# Altium schematic sheet RS232_485_dsPIC30.SchDoc
size A
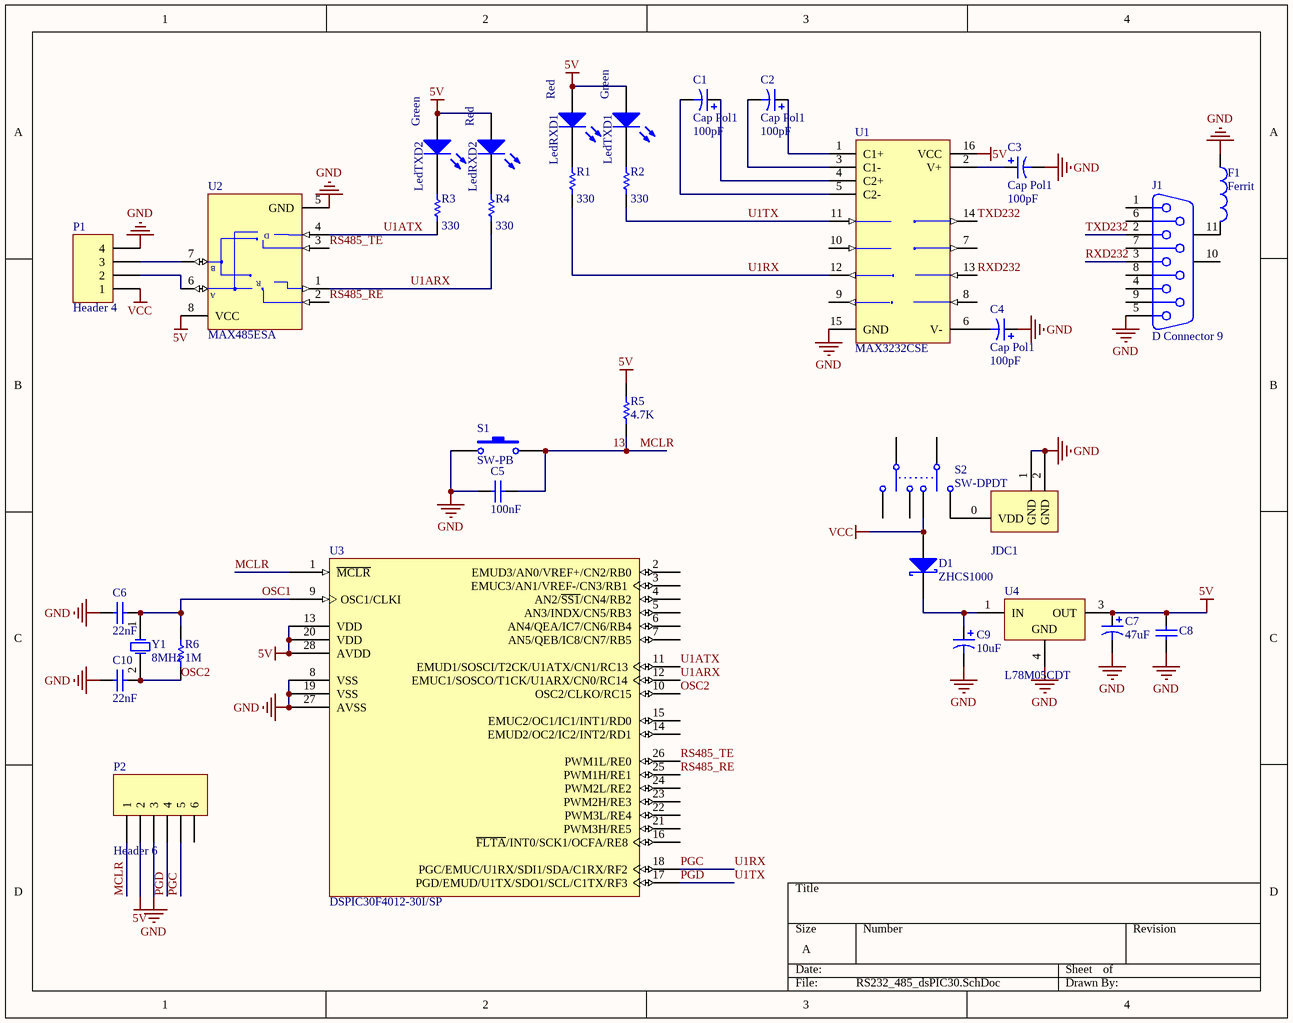
[diagram p0: RS232_485_dsPIC30.SchDoc]

## Parts
C1  Cap Pol1  value 100pF  [CAPPR2-5x6.8]
C2  Cap Pol1  value 100pF  [CAPPR2-5x6.8]
C3  Cap Pol1  value 100pF  [CAPPR2-5x6.8]
C4  Cap Pol1  value 100pF  [CAPPR2-5x6.8]
C5  value 100nF  [CAPC1608L]  (hidden comment: Cap Semi)
C6  value 22nF  [CAPC1608L]  (hidden comment: Cap Semi)
C7  value 47uF  [CAP4060L]  (hidden comment: Cap Pol3)
C8  Cap Semi  [CAPC1608L]  (value not drawn)
C9  value 10uF  [CAPC3216L]  (hidden comment: Cap Pol3)
C10  value 22nF  [CAPC1608L]  (hidden comment: Cap Semi)
D1  ZHCS1000  [SOT95P240-3N]
F1  Ferrit  [INDC2012L]
J1  D Connector 9  [DSUB1.385-2H9]
JDC1  Jac_DC  [Jac_DC_C]  (value not drawn)
LedRXD1  Red  [RESC2012N]
LedRXD2  Red  [RESC2012N]
LedTXD1  Green  [RESC2012N]
LedTXD2  Green  [RESC2012N]
P1  Header 4  [HEADERCN04A]
P2  Header 6  [HDR1X6]
R1  value 330  [RESC2012N]  (hidden comment: Res Semi)
R2  value 330  [RESC2012N]  (hidden comment: Res Semi)
R3  value 330  [RESC2012N]  (hidden comment: Res Semi)
R4  value 330  [RESC2012N]  (hidden comment: Res Semi)
R5  value 4.7K  [RESC2012L]  (hidden comment: Res Semi)
R6  value 1M  [RESC2012L]  (hidden comment: Res Semi)
S1  SW-PB  [SPST-2]
S2  SW-DPDT  [DPDT-6]
U1  MAX3232CSE  [JE16]
U2  MAX485ESA  [JA8A]
U3  DSPIC30F4012-30I/SP  [SPDIP300-SP28]
U4  L78M05CDT  [TO-252]
Y1  8MHz  [RAD-0.2]

## Nets
5V: C7.1 C8.2 LedRXD1.1(A) LedRXD2.1(A) LedTXD1.1(A) LedTXD2.1(A) P2.2 R5.2 U1.16(VCC) U2.8(VCC) U3.13(VDD) U3.20(VDD) U3.28(AVDD) U4.3(OUT)
GND: C3.2 C4.1 C5.1 C6.1 C7.2 C8.1 C9.2 C10.1 F1.1 J1.5 JDC1.1(GND) JDC1.2(GND) P1.4 P2.3 S1.1 U1.15(GND) U2.5(GND) U3.8(VSS) U3.19(VSS) U3.27(AVSS) U4.4(GND)
VCC: D1.1(A) P1.1 S2.3
13: C5.2 P2.1 R5.1 S1.2 U3.1(~{MCLR})  [also labelled MCLR]
OSC1: C6.2 R6.1 U3.9(OSC1/CLKI) Y1.1(OSC1)
OSC2: C10.2 R6.2 U3.10(OSC2/CLKO/RC15) Y1.2(OSC2)
PGC: P2.5 R1.2 U1.12(R1OUT) U3.18(PGC/EMUC/U1RX/SDI1/SDA/C1RX/RF2)  [also labelled U1RX]
PGD: P2.4 R2.2 U1.11(T1IN) U3.17(PGD/EMUD/U1TX/SDO1/SCL/C1TX/RF3)  [also labelled U1TX]
RS485_RE: U2.2(~{RE}) U3.25(PWM1H/RE1)
RS485_TE: U2.3(DE) U3.26(PWM1L/RE0)
RXD232: J1.3 U1.13(R1IN)
TXD232: J1.2 U1.14(T1OUT)
U1ARX: R4.2 U2.1(RO) U3.12(EMUC1/SOSCO/T1CK/U1ARX/CN0/RC14)
U1ATX: R3.2 U2.4(DI) U3.11(EMUD1/SOSCI/T2CK/U1ATX/CN1/RC13)
NetC1_1: C1.1 U1.4(C2+)
NetC1_2: C1.2 U1.5(C2-)
NetC2_1: C2.1 U1.1(C1+)
NetC2_2: C2.2 U1.3(C1-)
NetC3_1: C3.1 U1.2(V+)
NetC4_2: C4.2 U1.6(V-)
NetC9_1: C9.1 D1.3(K) U4.1(IN)
NetF1_2: F1.2 J1.11(MH2)
NetJDC1_0: JDC1.0(VDD) S2.2
NetLedRXD1_2: LedRXD1.2(K) R1.1
NetLedRXD2_2: LedRXD2.2(K) R4.1
NetLedTXD1_2: LedTXD1.2(K) R2.1
NetLedTXD2_2: LedTXD2.2(K) R3.1
NetP1_2: P1.2 U2.6(A)
NetP1_3: P1.3 U2.7(B)

Not connected (* = marked no-connect by the designer): J1 1 4 6 7 8 9 10(MH1); P2 6; S2 1 4 5 6; U1 7(T2OUT) 8(R2IN) 9(R2OUT) 10(T2IN); U3 2(EMUD3/AN0/VREF+/CN2/RB0) 3(EMUC3/AN1/VREF-/CN3/RB1) 4(AN2/~{SS1}/CN4/RB2) 5(AN3/INDX/CN5/RB3) 6(AN4/QEA/IC7/CN6/RB4) 7(AN5/QEB/IC8/CN7/RB5) 14(EMUD2/OC2/IC2/INT2/RD1) 15(EMUC2/OC1/IC1/INT1/RD0) 16(~{FLTA}/INT0/SCK1/OCFA/RE8) 21(PWM3H/RE5) 22(PWM3L/RE4) 23(PWM2H/RE3) 24(PWM2L/RE2)

## Notes on the sheet
- (in symbol MAX485ESA) D; R

## Library data of the parts
C1-C4 = Cap Pol1: Polarized Capacitor (Radial); Published: 8-Jun-2000; LatestRevisionDate: 17-Jul-2002; LatestRevisionNote: Re-released for DXP Platform.; PackageReference: RB7.6-15; Publisher: Altium Limited
C5 C6 C10 = Cap Semi: Capacitor (Semiconductor SIM Model); Published: 8-Jun-2000; LatestRevisionDate: 29-May-2009; LatestRevisionNote: IPC-7351 Footprint Added.; PackageReference: C1206; Publisher: Altium Limited; PackageDescription: Chip Capacitor
C7 C9 = Cap Pol3: Polarized Capacitor (Surface Mount); Published: 8-Jun-2000; LatestRevisionDate: 29-May-2009; LatestRevisionNote: IPC-7351 Footprint Added.; PackageReference: C0805; Publisher: Altium Limited; PackageDescription: Chip Capacitor
C8 = Cap Semi: Capacitor (Semiconductor SIM Model); Value: 100nF; Published: 8-Jun-2000; LatestRevisionDate: 29-May-2009; LatestRevisionNote: IPC-7351 Footprint Added.; PackageReference: C1206; Publisher: Altium Limited; PackageDescription: Chip Capacitor
D1 = Diode BAS70: Silicon AF Schottky Diode for High-Speed Switching; Note: Pin 2 is not connected and not drawn.; Published: 21-Mar-2003; LatestRevisionDate: 29-May-2009; LatestRevisionNote: IPC-7351 Footprint Added.; DatasheetVersion: Oct-1999; PackageVersion: Sep-2001; PackageReference: SOT-23; Publisher: Altium Limited; PackageDescription: 3-Pin SOT-23 Package 0.95 mm Pitch, 2.5 mm Lead Span; ComponentLink1Description: Manufacturer Link; ComponentLink1URL: http://www.infineon.com/; ComponentLink2Description: Datasheet; ComponentLink2URL: http://www.infineon.com/upload/Document/cmc_upload/documents/009/382/bas40_bas140series_1.pdf
F1 = Inductor: Code_IEC: 1005; Value: 600om; Published: 8-Jun-2000; LatestRevisionDate: 29-May-2009; LatestRevisionNote: IPC-7351 Footprint Added.; PackageReference: 0402-A; Publisher: Altium Limited; PackageDescription: Chip Inductor; Code_JEITA: 0402
J1 = D Connector 9: Receptacle Assembly, 9 Position, Right Angle; PackageDocument: O; Positions: 9; Published: 15-Jun-2001; LatestRevisionDate: 17-Jul-2002; LatestRevisionNote: Re-released for DXP Platform.; DatasheetDocument: 1-Sep-1999; PackageReference: 788750; Publisher: Altium Limited; Orientation: Right Angle; Gender: Receptacle
LedRXD1 LedRXD2 LedTXD1 LedTXD2 = LED2: Typical RED, GREEN, YELLOW, AMBER GaAs LED; Published: 8-Jun-2000; LatestRevisionDate: 17-Jul-2002; LatestRevisionNote: Re-released for DXP Platform.; PackageVersion: Feb-2002; PackageReference: 3.2X1.6X1.1; Publisher: Altium Limited
P1 = Header 4: Header, 4-Pin; LatestRevisionDate: 17-Jul-2002; LatestRevisionNote: Re-released for DXP Platform.; Publisher: Altium Limited
P2 = Header 6: Header, 6-Pin; LatestRevisionDate: 17-Jul-2002; LatestRevisionNote: Re-released for DXP Platform.; Publisher: Altium Limited
R1-R6 = Res Semi: Semiconductor Resistor; Published: 8-Jun-2000; LatestRevisionDate: 17-Jul-2002; LatestRevisionNote: Re-released for DXP Platform.; PackageReference: AXIAL-0.5; Publisher: Altium Limited
S1 = SW-PB: Switch; Published: 24-Mar-1999; LatestRevisionDate: 17-Jul-2002; LatestRevisionNote: Re-released for DXP Platform.; PackageReference: SPST-2; Publisher: Altium Limited
S2 = SW-DPDT: Double-Pole, Double-Throw Switch; Published: 24-Mar-1999; LatestRevisionDate: 17-Jul-2002; LatestRevisionNote: Re-released for DXP Platform.; PackageReference: DPDT-6; Publisher: Altium Limited
U1 = MAX3232CSE: 3.0V TO 5.5V, Low-Power, up to 1Mbps, True RS-232 Transceiver Using Four 0.1µF External Capacitor; Published: 16-Jan-2001; LatestRevisionDate: 13-Apr-2006; LatestRevisionNote: IPC-7351 Footprint Added.; DatasheetVersion: Mar-1999; PackageReference: NSO16; Publisher: Altium Limited; PackageDescription: 16-Pin Small Outline Integrated Circuit 1.27 mm Pitch; Code_JEDEC: MS-012-AC; Code_IPC: SOIC127P600-16; ComponentLink1Description: Manufacturer Link; ComponentLink1URL: http://www.maxim-ic.com/; ComponentLink2Description: Datasheet; ComponentLink2URL: http://pdfserv.maxim-ic.com/en/ds/MAX3222-MAX3241.pdf
U2 = MAX485ESA: Low-Power, Slew-Rate-Limited RS-485/RS-422 Transceiver; Published: 16-Jan-2001; LatestRevisionDate: 13-Apr-2006; LatestRevisionNote: IPC-7351 Footprint Added.; DatasheetVersion: Feb-1996; PackageReference: NSO8; Publisher: Altium Limited; PackageDescription: 8-Pin Small Outline Integrated Circuit 1.27 mm Pitch; Code_JEDEC: MS-012-AA; Code_IPC: SOIC127P600-8; ComponentLink1Description: Manufacturer Link; ComponentLink1URL: http://www.maxim-ic.com/; ComponentLink2Description: Datasheet; ComponentLink2URL: http://pdfserv.maxim-ic.com/en/ds/MAX1487-MAX491.pdf
U3 = DSPIC30F4012-30I/SP: High-Performance 16-bit Digital Signal Controller, 48 KB Flash, 2 KB SRAM, 1 KB EEPROM, 28-Pin SPDIP, Industrial Temperature; FirstPublished: 29-Jan-2009; DatasheetVersion: revF, Jul-2008; PackageVersion: revBB, Aug-2009; PackageReference: SPDIP300-SP28; Publisher: Altium Limited; PackageDescription: 28-Lead Skinny Plastic Dual In-Line (SP) - 300 mil Body [SPDIP]; Supplier 1: Digi-Key; Supplier Part Number 1: DSPIC30F401230ISP-ND; Supplier 2: Farnell; Supplier Part Number 2: 1294856; Supplier 3: Newark; Supplier Part Number 3: 68K3310; ComponentLink1Description: Datasheet; ComponentLink1URL: http://ww1.microchip.com/downloads/en/DeviceDoc/70135F.pdf; ComponentLink2Description: Packaging Specification; ComponentLink2URL: http://www.microchip.com/stellent/groups/techpub_sg/documents/packagingspec/en012702.pdf; ComponentLink3Description: Microchip.com Home; ComponentLink3URL: http://www.microchip.com/
U4 = L78M05CDT: Positive Voltage Regulator; Published: 24-Aug-2001; LatestRevisionDate: 06-Jun-2005; LatestRevisionNote: PCB pads lengthened.; DatasheetVersion: Apr-1994; PackageVersion: Jun-2004; PackageReference: TO-252; Publisher: Altium Limited; PackageDescription: D-PAK/TO-252-AA; 3 Leads (1 Cropped); Body 10.1 (inc. leads) x 6.6 mm (LxW max); ComponentLink1Description: Manufacturer Link; ComponentLink1URL: http://www.st.com/; ComponentLink2Description: Datasheet; ComponentLink2URL: http://www.st.com/stonline/products/literature/ds/2146/l78m05c.pdf
Y1 = XTAL: Crystal Oscillator; Published: 8-Jun-2000; LatestRevisionDate: 17-Jul-2002; LatestRevisionNote: Re-released for DXP Platform.; PackageReference: R38; Publisher: Altium Limited